# EAGLE design Pinscape Pico-KL25Z Adapter (EAGLE 7.7.0)

## Sheet 1 of 4: Main
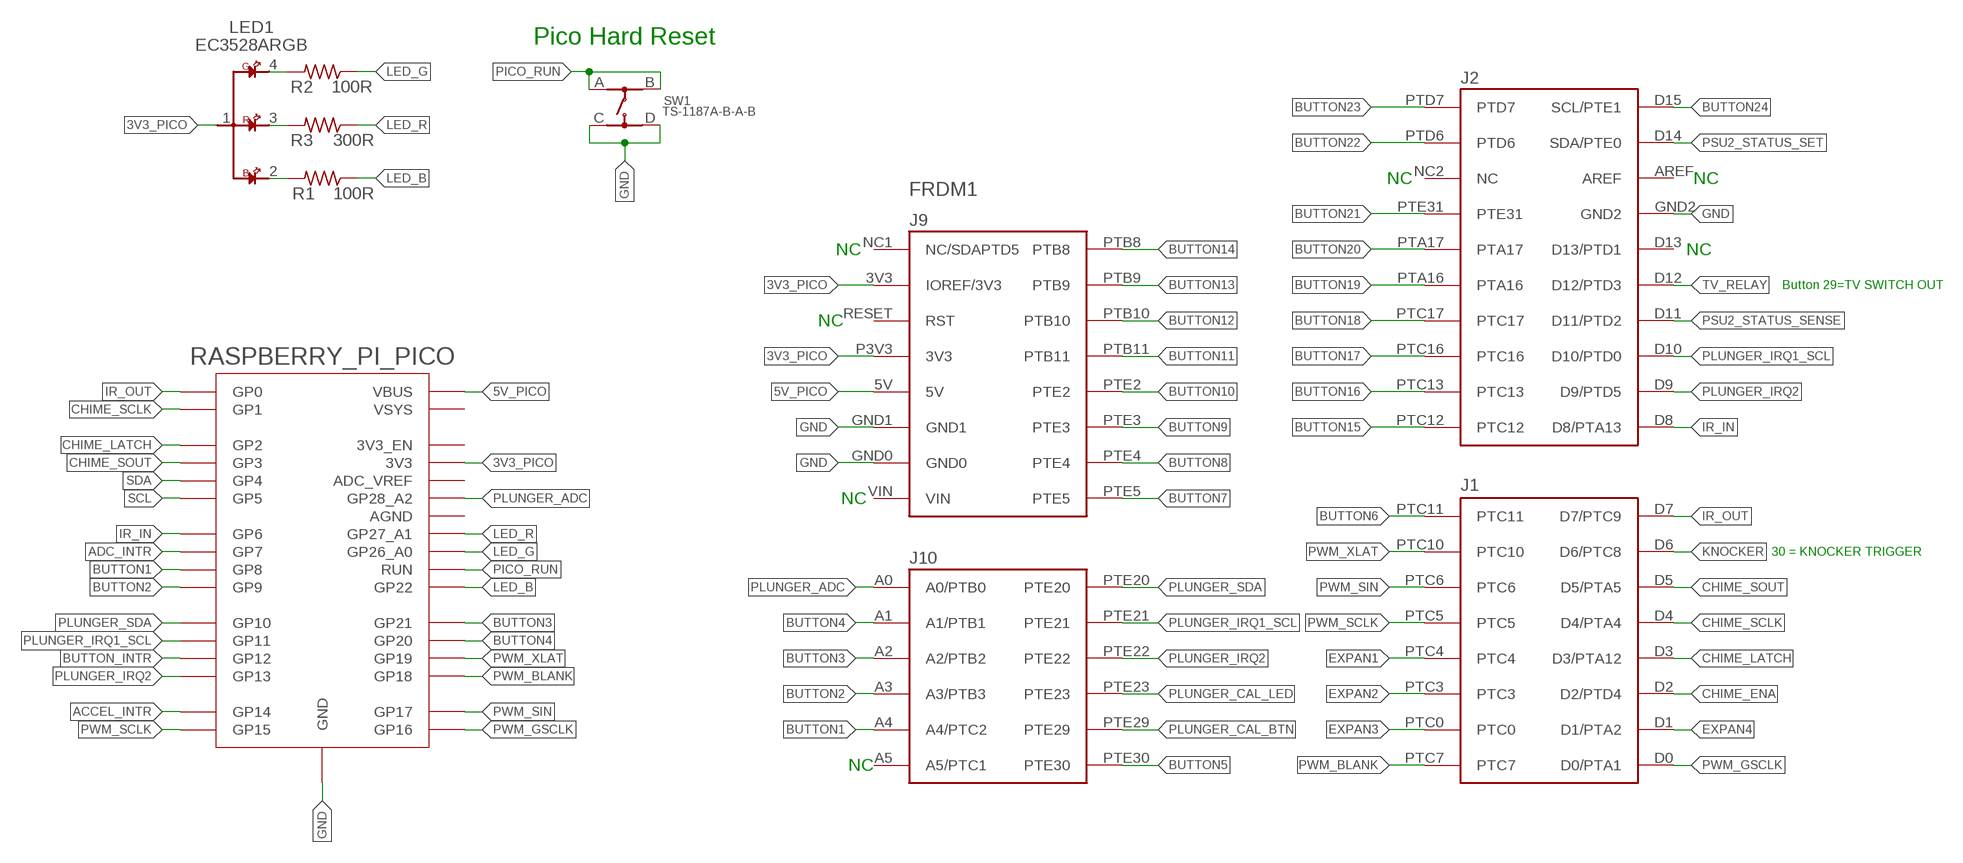
[diagram p0: schematic, sheet 1]

### Parts
FRDM1  KL25Z  FRDM-KL25ZNORMAL  [FRDM_KL25Z_NORMAL]
LED1  EC3528ARGB  [EC3528ARGB]
R1  100R  R-US_R1206  [R1206]
R2  100R  R-US_R1206  [R1206]
R3  300R  R-US_R1206  [R1206]
RASPBERRY_PI_PICO  RPI_PICO_NO_DEBUG  [RPI_PICO_TH_NO_DEBUG]
SW1  TS-1187A-B-A-B  [TS-1187A-B-A-B]

### Nets
3V3_PICO: FRDM1.3V3(IOREF/3V3) FRDM1.P3V3(3V3) LED1.1 RASPBERRY_PI_PICO.3V3 ; also sheet 2,3,4
5V_PICO: FRDM1.5V RASPBERRY_PI_PICO.VBUS
ACCEL_INTR: RASPBERRY_PI_PICO.GP14 ; also sheet 3
ADC_INTR: RASPBERRY_PI_PICO.GP7 ; also sheet 4
BUTTON1: FRDM1.A4(A4/PTC2) RASPBERRY_PI_PICO.GP8
BUTTON2: FRDM1.A3(A3/PTB3) RASPBERRY_PI_PICO.GP9
BUTTON3: FRDM1.A2(A2/PTB2) RASPBERRY_PI_PICO.GP21
BUTTON4: FRDM1.A1(A1/PTB1) RASPBERRY_PI_PICO.GP20
BUTTON5: FRDM1.PTE30 ; also sheet 2
BUTTON6: FRDM1.PTC11 ; also sheet 2
BUTTON7: FRDM1.PTE5 ; also sheet 2
BUTTON8: FRDM1.PTE4 ; also sheet 2
BUTTON9: FRDM1.PTE3 ; also sheet 2
BUTTON10: FRDM1.PTE2 ; also sheet 2
BUTTON11: FRDM1.PTB11 ; also sheet 2
BUTTON12: FRDM1.PTB10 ; also sheet 2
BUTTON13: FRDM1.PTB9 ; also sheet 2
BUTTON14: FRDM1.PTB8 ; also sheet 2
BUTTON15: FRDM1.PTC12 ; also sheet 2
BUTTON16: FRDM1.PTC13 ; also sheet 2
BUTTON17: FRDM1.PTC16 ; also sheet 2
BUTTON18: FRDM1.PTC17 ; also sheet 2
BUTTON19: FRDM1.PTA16 ; also sheet 2
BUTTON20: FRDM1.PTA17 ; also sheet 2
BUTTON21: FRDM1.PTE31 ; also sheet 2
BUTTON22: FRDM1.PTD6 ; also sheet 2
BUTTON23: FRDM1.PTD7 ; also sheet 2
BUTTON24: FRDM1.D15(SCL/PTE1) ; also sheet 2
BUTTON_INTR: RASPBERRY_PI_PICO.GP12 ; also sheet 2
CHIME_ENA: FRDM1.D2(D2/PTD4) ; also sheet 2
CHIME_LATCH: FRDM1.D3(D3/PTA12) RASPBERRY_PI_PICO.GP2
CHIME_SCLK: FRDM1.D4(D4/PTA4) RASPBERRY_PI_PICO.GP1
CHIME_SOUT: FRDM1.D5(D5/PTA5) RASPBERRY_PI_PICO.GP3
EXPAN1: FRDM1.PTC4 ; also sheet 2
EXPAN2: FRDM1.PTC3 ; also sheet 2
EXPAN3: FRDM1.PTC0 ; also sheet 2
EXPAN4: FRDM1.D1(D1/PTA2) ; also sheet 2
GND: FRDM1.GND0 FRDM1.GND1 FRDM1.GND2 RASPBERRY_PI_PICO.GND@1(GND) RASPBERRY_PI_PICO.GND@2(GND) RASPBERRY_PI_PICO.GND@3(GND) RASPBERRY_PI_PICO.GND@4(GND) RASPBERRY_PI_PICO.GND@6(GND) RASPBERRY_PI_PICO.GND@7(GND) RASPBERRY_PI_PICO.GND@8(GND) SW1.C SW1.D ; also sheet 2,3,4
IR_IN: FRDM1.D8(D8/PTA13) RASPBERRY_PI_PICO.GP6
IR_OUT: FRDM1.D7(D7/PTC9) RASPBERRY_PI_PICO.GP0
KNOCKER: FRDM1.D6(D6/PTC8) ; also sheet 2
LED_B: R1.1 RASPBERRY_PI_PICO.GP22
LED_G: R2.1 RASPBERRY_PI_PICO.GP26_A0
LED_R: R3.1 RASPBERRY_PI_PICO.GP27_A1
N$8: LED1.3 R3.2
N$10: LED1.2 R1.2
N$13: LED1.4 R2.2
PICO_RUN: RASPBERRY_PI_PICO.RUN SW1.A SW1.B
PLUNGER_ADC: FRDM1.A0(A0/PTB0) RASPBERRY_PI_PICO.GP28_A2 ; also sheet 4
PLUNGER_CAL_BTN: FRDM1.PTE29 ; also sheet 2
PLUNGER_CAL_LED: FRDM1.PTE23 ; also sheet 2
PLUNGER_IRQ1_SCL: FRDM1.D10(D10/PTD0) FRDM1.PTE21 RASPBERRY_PI_PICO.GP11
PLUNGER_IRQ2: FRDM1.D9(D9/PTD5) FRDM1.PTE22 RASPBERRY_PI_PICO.GP13
PLUNGER_SDA: FRDM1.PTE20 RASPBERRY_PI_PICO.GP10
PSU2_STATUS_SENSE: FRDM1.D11(D11/PTD2) ; also sheet 2
PSU2_STATUS_SET: FRDM1.D14(SDA/PTE0) ; also sheet 2
PWM_BLANK: FRDM1.PTC7 RASPBERRY_PI_PICO.GP18
PWM_GSCLK: FRDM1.D0(D0/PTA1) RASPBERRY_PI_PICO.GP16
PWM_SCLK: FRDM1.PTC5 RASPBERRY_PI_PICO.GP15
PWM_SIN: FRDM1.PTC6 RASPBERRY_PI_PICO.GP17
PWM_XLAT: FRDM1.PTC10 RASPBERRY_PI_PICO.GP19
SCL: RASPBERRY_PI_PICO.GP5 ; also sheet 2,3,4
SDA: RASPBERRY_PI_PICO.GP4 ; also sheet 2,3,4
TV_RELAY: FRDM1.D12(D12/PTD3) ; also sheet 2
Unconnected: FRDM1.A5(A5/PTC1) FRDM1.AREF FRDM1.D13(D13/PTD1) FRDM1.NC1(NC/SDAPTD5) FRDM1.NC2(NC) FRDM1.RESET(RST) FRDM1.VIN RASPBERRY_PI_PICO.3V3_EN RASPBERRY_PI_PICO.ADC_VREF RASPBERRY_PI_PICO.AGND RASPBERRY_PI_PICO.VSYS

### Notes on the sheet
- Pico Hard Reset
- NC | NC
- NC | NC
- Button 29=TV SWITCH OUT
- NC
- NC
- 30 = KNOCKER TRIGGER
- NC

## Sheet 2 of 4: PCA9555
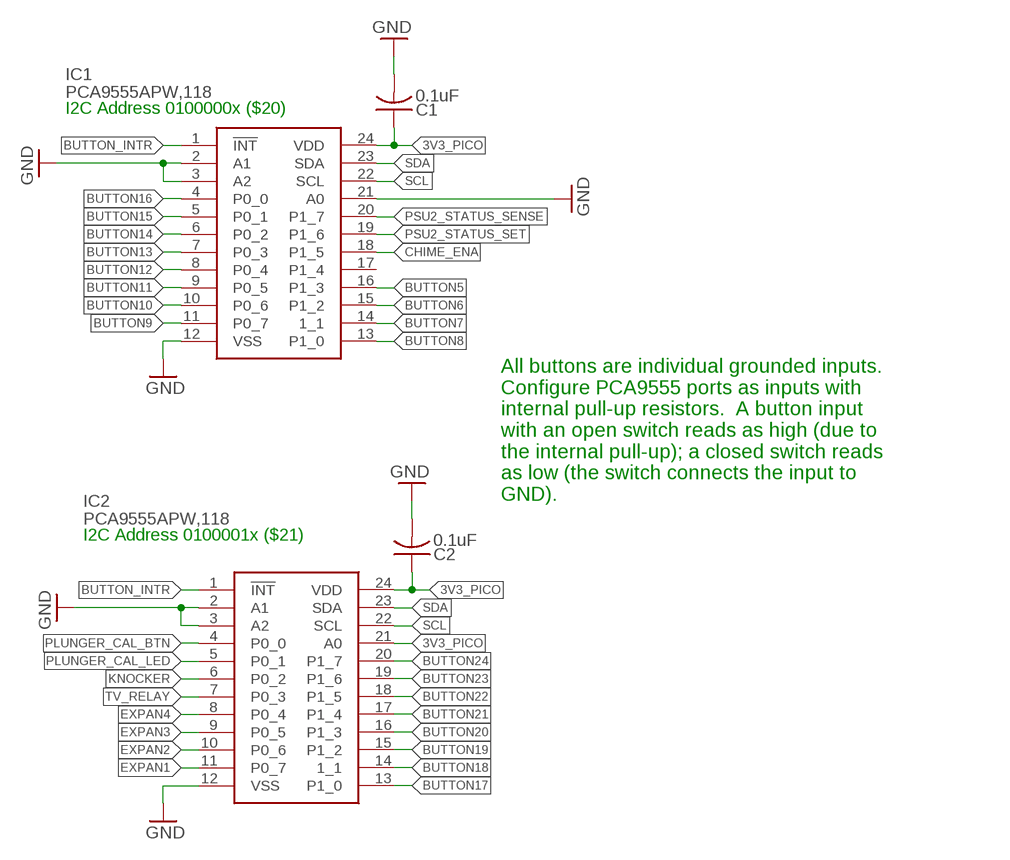
[diagram p1: schematic, sheet 2]

### Parts
C1  0.1uF  C-USC1206  [C1206]
C2  0.1uF  C-USC1206  [C1206]
IC1  PCA9555APW,118  [SOP65P640X110-24N]
IC2  PCA9555APW,118  [SOP65P640X110-24N]

### Nets
3V3_PICO: C1.1 C2.1 IC1.24(VDD) IC2.21(A0) IC2.24(VDD) ; also sheet 1,3,4
BUTTON5: IC1.16(P1_3) ; also sheet 1
BUTTON6: IC1.15(P1_2) ; also sheet 1
BUTTON7: IC1.14(1_1) ; also sheet 1
BUTTON8: IC1.13(P1_0) ; also sheet 1
BUTTON9: IC1.11(P0_7) ; also sheet 1
BUTTON10: IC1.10(P0_6) ; also sheet 1
BUTTON11: IC1.9(P0_5) ; also sheet 1
BUTTON12: IC1.8(P0_4) ; also sheet 1
BUTTON13: IC1.7(P0_3) ; also sheet 1
BUTTON14: IC1.6(P0_2) ; also sheet 1
BUTTON15: IC1.5(P0_1) ; also sheet 1
BUTTON16: IC1.4(P0_0) ; also sheet 1
BUTTON17: IC2.13(P1_0) ; also sheet 1
BUTTON18: IC2.14(1_1) ; also sheet 1
BUTTON19: IC2.15(P1_2) ; also sheet 1
BUTTON20: IC2.16(P1_3) ; also sheet 1
BUTTON21: IC2.17(P1_4) ; also sheet 1
BUTTON22: IC2.18(P1_5) ; also sheet 1
BUTTON23: IC2.19(P1_6) ; also sheet 1
BUTTON24: IC2.20(P1_7) ; also sheet 1
BUTTON_INTR: IC1.1(!INT) IC2.1(!INT) ; also sheet 1
CHIME_ENA: IC1.18(P1_5) ; also sheet 1
EXPAN1: IC2.11(P0_7) ; also sheet 1
EXPAN2: IC2.10(P0_6) ; also sheet 1
EXPAN3: IC2.9(P0_5) ; also sheet 1
EXPAN4: IC2.8(P0_4) ; also sheet 1
GND: C1.2 C2.2 IC1.2(A1) IC1.3(A2) IC1.12(VSS) IC1.21(A0) IC2.2(A1) IC2.3(A2) IC2.12(VSS) ; also sheet 1,3,4
KNOCKER: IC2.6(P0_2) ; also sheet 1
PLUNGER_CAL_BTN: IC2.4(P0_0) ; also sheet 1
PLUNGER_CAL_LED: IC2.5(P0_1) ; also sheet 1
PSU2_STATUS_SENSE: IC1.20(P1_7) ; also sheet 1
PSU2_STATUS_SET: IC1.19(P1_6) ; also sheet 1
SCL: IC1.22(SCL) IC2.22(SCL) ; also sheet 1,3,4
SDA: IC1.23(SDA) IC2.23(SDA) ; also sheet 1,3,4
TV_RELAY: IC2.7(P0_3) ; also sheet 1
Unconnected: IC1.17(P1_4)

### Notes on the sheet
- I2C Address 0100000x ($20)
- All buttons are individual grounded inputs.
  Configure PCA9555 ports as inputs with
  internal pull-up resistors.  A button input
  with an open switch reads as high (due to
  the internal pull-up); a closed switch reads
  as low (the switch connects the input to
  GND).
- I2C Address 0100001x ($21)

## Sheet 3 of 4: Accelerometer
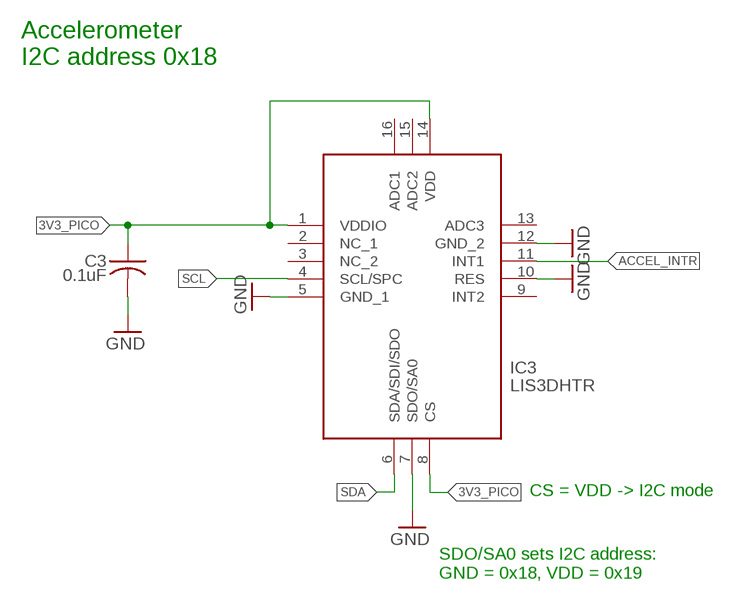
[diagram p2: schematic, sheet 3]

### Parts
C3  0.1uF  C-USC1206  [C1206]
IC3  LIS3DHTR  [LIS3DHTR]

### Nets
3V3_PICO: C3.1 IC3.1(VDDIO) IC3.8(CS) IC3.14(VDD) ; also sheet 1,2,4
ACCEL_INTR: IC3.11(INT1) ; also sheet 1
GND: C3.2 IC3.5(GND_1) IC3.7(SDO/SA0) IC3.10(RES) IC3.12(GND_2) ; also sheet 1,2,4
SCL: IC3.4(SCL/SPC) ; also sheet 1,2,4
SDA: IC3.6(SDA/SDI/SDO) ; also sheet 1,2,4
Unconnected: IC3.2(NC_1) IC3.3(NC_2) IC3.9(INT2) IC3.13(ADC3) IC3.15(ADC2) IC3.16(ADC1)

### Notes on the sheet
- Accelerometer
  I2C address 0x18
- CS = VDD -> I2C mode
- SDO/SA0 sets I2C address:
  GND = 0x18, VDD = 0x19

## Sheet 4 of 4: ADC
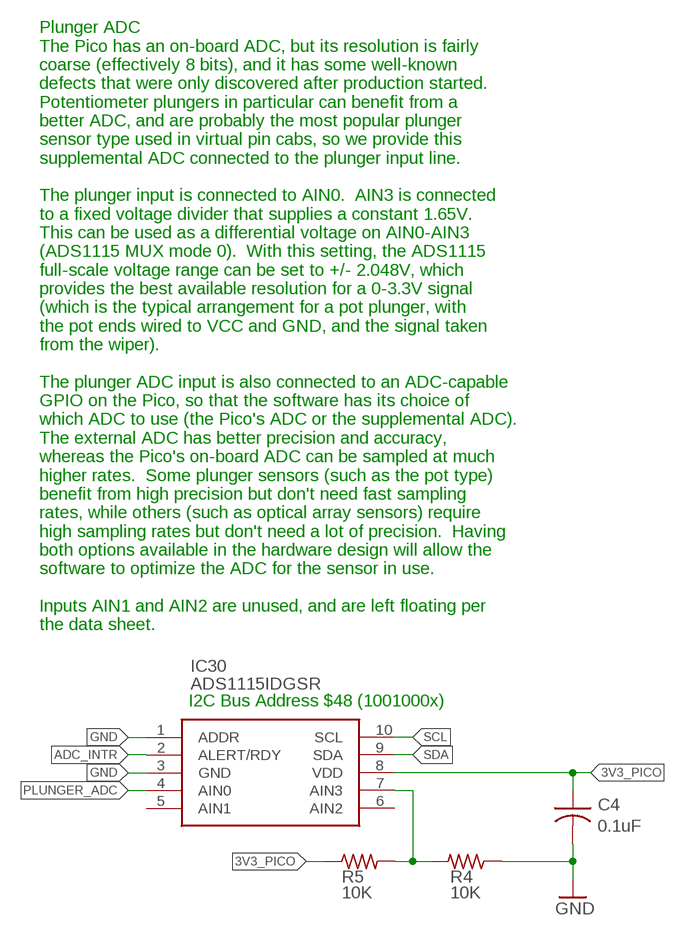
[diagram p3: schematic, sheet 4]

### Parts
C4  0.1uF  C-USC1206  [C1206]
IC30  ADS1115IDGSR  [SOP50P490X110-10N]
R4  10K  R-US_R1206  [R1206]
R5  10K  R-US_R1206  [R1206]

### Nets
3V3_PICO: C4.1 IC30.8(VDD) R5.1 ; also sheet 1,2,3
ADC_INTR: IC30.2(ALERT/RDY) ; also sheet 1
GND: C4.2 IC30.1(ADDR) IC30.3(GND) R4.1 ; also sheet 1,2,3
N$71: IC30.7(AIN3) R4.2 R5.2
PLUNGER_ADC: IC30.4(AIN0) ; also sheet 1
SCL: IC30.10(SCL) ; also sheet 1,2,3
SDA: IC30.9(SDA) ; also sheet 1,2,3
Unconnected: IC30.5(AIN1) IC30.6(AIN2)

### Notes on the sheet
- Plunger ADC
  The Pico has an on-board ADC, but its resolution is fairly
  coarse (effectively 8 bits), and it has some well-known
  defects that were only discovered after production started.
  Potentiometer plungers in particular can benefit from a
  better ADC, and are probably the most popular plunger
  sensor type used in virtual pin cabs, so we provide this
  supplemental ADC connected to the plunger input line.
  
  The plunger input is connected to AIN0.  AIN3 is connected
  to a fixed voltage divider that supplies a constant 1.65V.
  This can be used as a differential voltage on AIN0-AIN3
  (ADS1115 MUX mode 0).  With this setting, the ADS1115
  full-scale voltage range can be set to +/- 2.048V, which
  provides the best available resolution for a 0-3.3V signal
  (which is the typical arrangement for a pot plunger, with
  the pot ends wired to VCC and GND, and the signal taken
  from the wiper).
  
  The plunger ADC input is also connected to an ADC-capable
  GPIO on the Pico, so that the software has its choice of
  which ADC to use (the Pico's ADC or the supplemental ADC).
  The external ADC has better precision and accuracy,
  whereas the Pico's on-board ADC can be sampled at much
  higher rates.  Some plunger sensors (such as the pot type)
  benefit from high precision but don't need fast sampling
  rates, while others (such as optical array sensors) require
  high sampling rates but don't need a lot of precision.  Having
  both options available in the hardware design will allow the
  software to optimize the ADC for the sensor in use.
  
  Inputs AIN1 and AIN2 are unused, and are left floating per
  the data sheet.
- I2C Bus Address $48 (1001000x)

## Library data of the parts
C1-C4 = rcl:C-US: CAPACITOR, American symbol
FRDM1 = kl25z:FRDM-KL25Z: For creating FRDM-KL25Z shields
IC1 IC2 = SamacSys_Parts:PCA9555APW,118: NXP - PCA9555APW,118 - I/O EXPANDER, 16BIT, 400KHZ, TSSOP-24 Source: Datasheet <http://www.nxp.com/docs/en/data-sheet/PCA9555A.pdf>; DESCRIPTION: NXP - PCA9555APW,118 - I/O EXPANDER, 16BIT, 400KHZ, TSSOP-24; HEIGHT: 1.1mm; MANUFACTURER_NAME: NXP; MANUFACTURER_PART_NUMBER: PCA9555APW,118; MOUSER_PART_NUMBER: 771-PCA9555APW118; MOUSER_PRICE-STOCK: https://www.mouser.co.uk/ProductDetail/NXP-Semiconductors/PCA9555APW118?qs=5C9Q4QJFsuPmpoGpn%2FKoIQ%3D%3D
IC3 = SamacSys_Parts:LIS3DHTR: Accelerometer 3-Axis 2g/16g 1.8V LGA16 STMicroelectronics LIS3DHTR Accelerometer IC, 3-axis, I2C, SPI 1.71 3.6 V, 16-Pin LGA Source: Datasheet <http://www.st.com/content/ccc/resource/technical/document/datasheet/3c/ae/50/85/d6/b1/46/fe/CD00274221.pdf/files/CD00274221.pdf/jcr:content/translations/en.CD00274221.pdf>; DESCRIPTION: Accelerometer 3-Axis 2g/16g 1.8V LGA16 STMicroelectronics LIS3DHTR Accelerometer IC, 3-axis, I2C, SPI 1.71 3.6 V, 16-Pin LGA; HEIGHT: 1mm; MANUFACTURER_NAME: STMicroelectronics; MANUFACTURER_PART_NUMBER: LIS3DHTR; MOUSER_PART_NUMBER: 511-LIS3DHTR; MOUSER_PRICE-STOCK: https://www.mouser.co.uk/ProductDetail/STMicroelectronics/LIS3DHTR?qs=6la6oa3D8xzhXYax3cEo4w%3D%3D
IC30 = SamacSys_Parts:ADS1115IDGSR: 16-Bit 860SPS 4-Ch Delta-Sigma ADC With PGA, Oscillator, Vref, Comparator, and I2C Source: Datasheet <http://www.ti.com/lit/gpn/ADS1115>; DESCRIPTION: 16-Bit 860SPS 4-Ch Delta-Sigma ADC With PGA, Oscillator, Vref, Comparator, and I2C; HEIGHT: 1.1mm; MANUFACTURER_NAME: Texas Instruments; MANUFACTURER_PART_NUMBER: ADS1115IDGSR; MOUSER_PART_NUMBER: 595-ADS1115IDGSR; MOUSER_PRICE-STOCK: https://www.mouser.co.uk/ProductDetail/Texas-Instruments/ADS1115IDGSR?qs=IK5e5L0zOXjKCJoVMhYO%2FQ%3D%3D
LED1 = SamacSys_Parts:EC3528ARGB: EC3528ARGB RGB LED, 5mA, common anode, SMD 3528 package; Dongguan Ousike Optoelectronics Technology Co., Ltd.
R1-R5 = resistor:R-US_: RESISTOR, American symbol
RASPBERRY_PI_PICO = RaspberryPi_Pico:RPI_PICO_NO_DEBUG
SW1 = SamacSys_Parts:TS-1187A-B-A-B

## Board
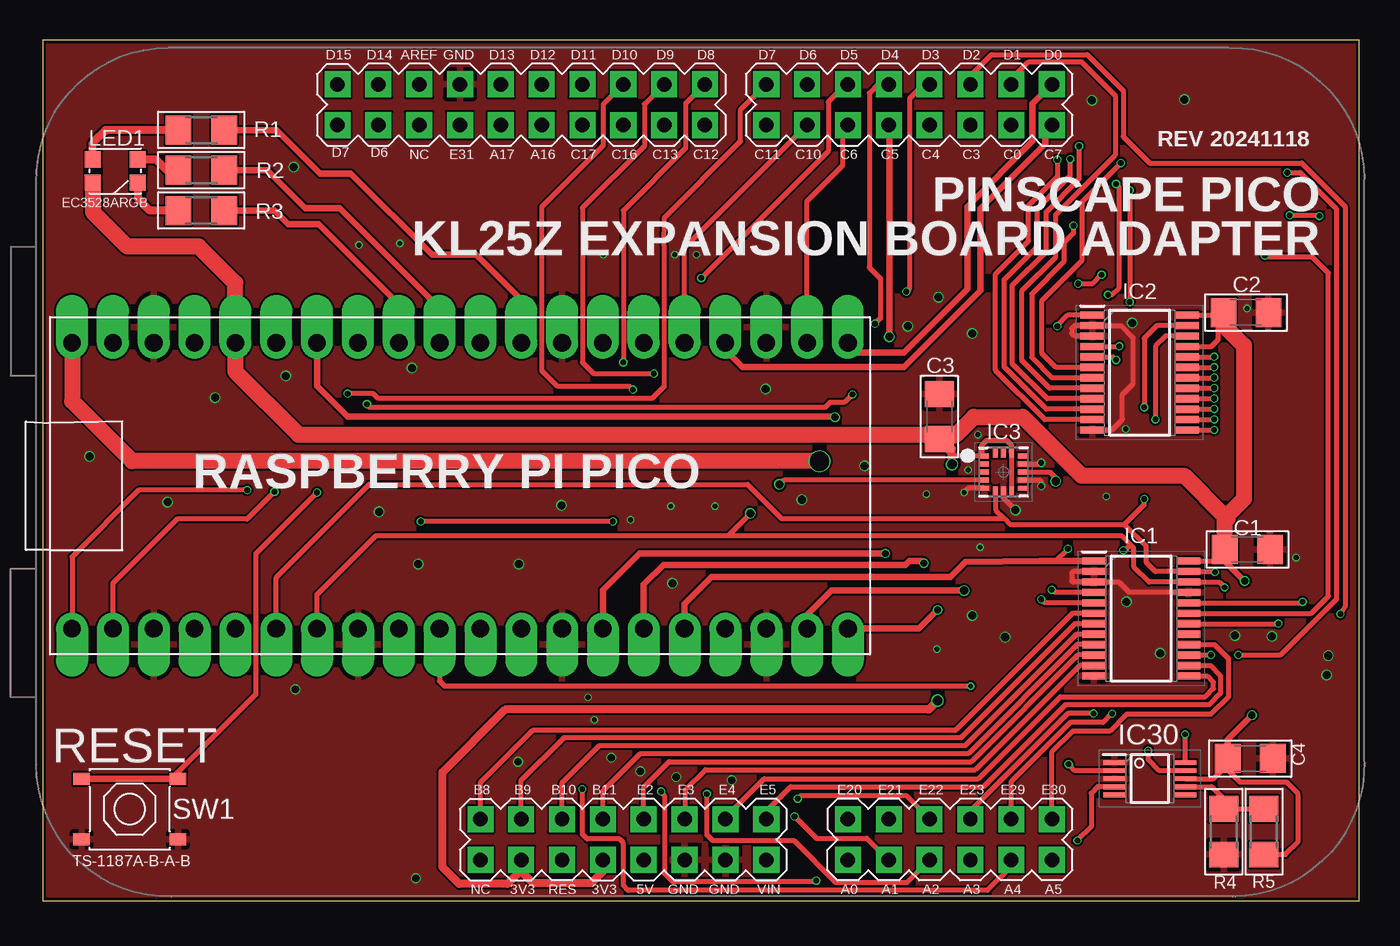
[diagram p4: board, top side]
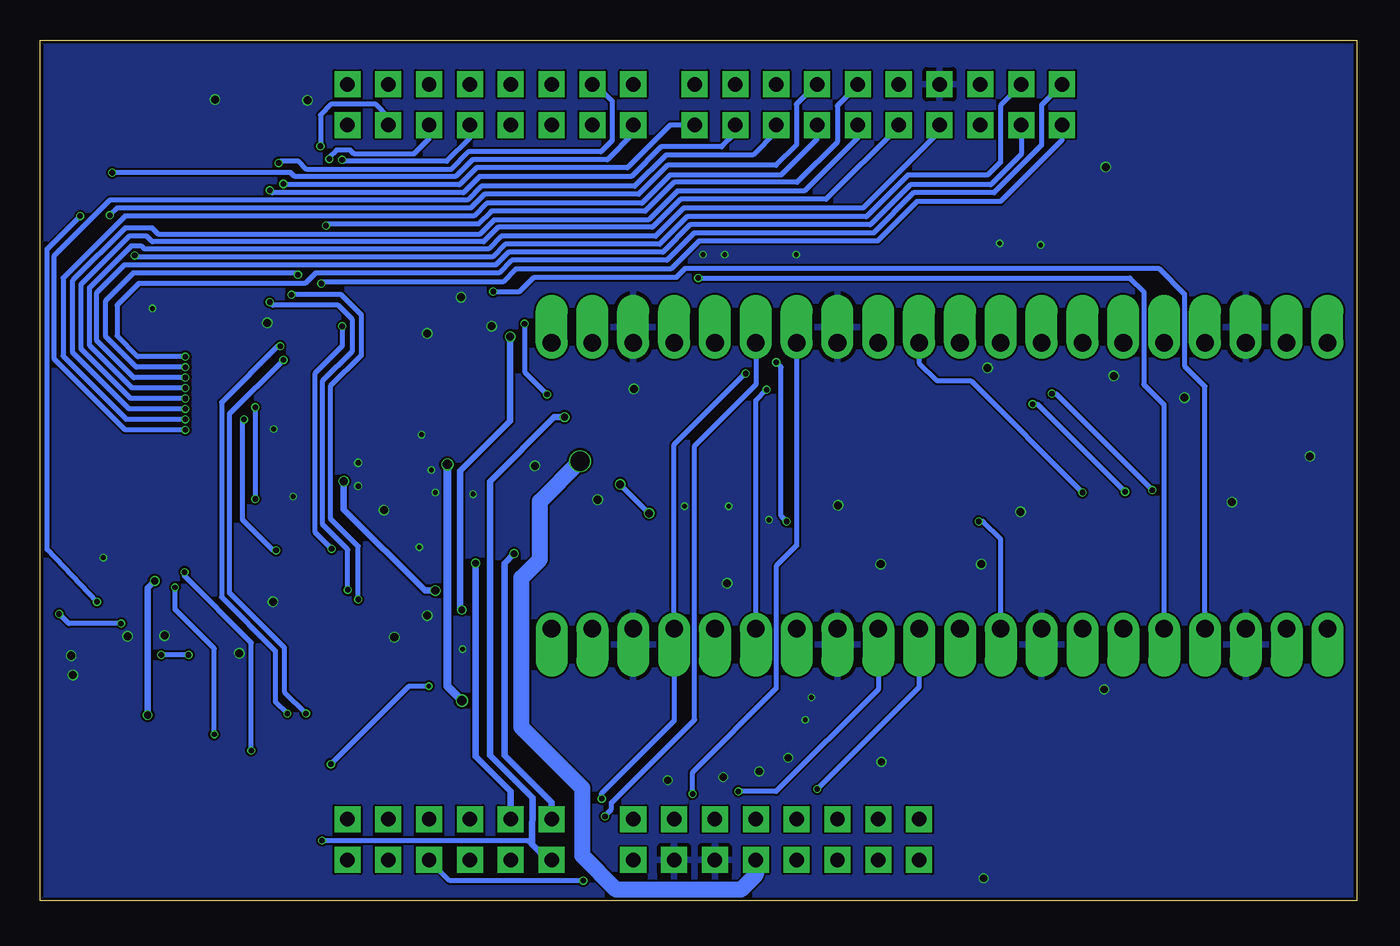
[diagram p5: board, bottom side, seen from below]

Size 81.88 x 53.54 mm. Coordinates in mm from the lower left corner, seen from the top.
Outline: 0,0 81.88,0 81.88,53.54 0,53.54 0,0
Copper layers (1*16): Top 0.035mm / dielectric 1.6mm / Bottom 0.035mm
Design rules "jlcpcb-2layers": minimum track width 5mil, minimum drill 0.3mm, track to track 5mil, track to pad 5mil, pad to pad 5mil, via to via 5mil, smd to smd 5mil, copper to edge 0.2mm, drill to drill 6mil, minimum pad ring 10mil, minimum via ring 3mil, stop-mask expansion 4mil, vias tented up to drill 0mil, thermal gap 10mil

### Footprints (pad centres in the part's own frame; a part is rotated, then mirrored left to right if it is on the bottom)
C1206 = smd 1.6 x 1.8: 1 -1.4,0; 2 1.4,0
FRDM_KL25Z_NORMAL = drill 0.9 square: 3V3 24.13,-15.24; 5V 24.13,-7.62; A0 24.13,5.08; A1 24.13,7.62; A2 24.13,10.16; A3 24.13,12.7; A4 24.13,15.24; A5 24.13,17.78; AREF -24.13,-21.59; D0 -24.13,17.78; D1 -24.13,15.24; D2 -24.13,12.7; D3 -24.13,10.16; D4 -24.13,7.62; D5 -24.13,5.08; D6 -24.13,2.54; D7 -24.13,0; D8 -24.13,-3.81; D9 -24.13,-6.35; D10 -24.13,-8.89; D11 -24.13,-11.43; D12 -24.13,-13.97; D13 -24.13,-16.51; D14 -24.13,-24.13; D15 -24.13,-26.67; GND0 24.13,-2.54; GND1 24.13,-5.08; GND2 -24.13,-19.05; NC1 24.13,-17.78; NC2 -21.59,-21.59; P3V3 24.13,-10.16; PTA16 -21.59,-13.97; PTA17 -21.59,-16.51; PTB8 21.59,-17.78; PTB9 21.59,-15.24; PTB10 21.59,-12.7; PTB11 21.59,-10.16; PTC0 -21.59,15.24; PTC3 -21.59,12.7; PTC4 -21.59,10.16; PTC5 -21.59,7.62; PTC6 -21.59,5.08; PTC7 -21.59,17.78; PTC10 -21.59,2.54; PTC11 -21.59,0; PTC12 -21.59,-3.81; PTC13 -21.59,-6.35; PTC16 -21.59,-8.89; PTC17 -21.59,-11.43; PTD6 -21.59,-24.13; PTD7 -21.59,-26.67; PTE2 21.59,-7.62; PTE3 21.59,-5.08; PTE4 21.59,-2.54; PTE5 21.59,0; PTE20 21.59,5.08; PTE21 21.59,7.62; PTE22 21.59,10.16; PTE23 21.59,12.7; PTE29 21.59,15.24; PTE30 21.59,17.78; PTE31 -21.59,-19.05; RESET 24.13,-12.7; VIN 24.13,0
SOP65P640X110-24N = smd 1.475 x 0.45: 1 -2.938,3.575; 2 -2.938,2.925; 3 -2.938,2.275; 4 -2.938,1.625; 5 -2.938,0.975; 6 -2.938,0.325; 7 -2.938,-0.325; 8 -2.938,-0.975; 9 -2.938,-1.625; 10 -2.938,-2.275; 11 -2.938,-2.925; 12 -2.938,-3.575; 13 2.938,-3.575; 14 2.938,-2.925; 15 2.938,-2.275; 16 2.938,-1.625; 17 2.938,-0.975; 18 2.938,-0.325; 19 2.938,0.325; 20 2.938,0.975; 21 2.938,1.625; 22 2.938,2.275; 23 2.938,2.925; 24 2.938,3.575
LIS3DHTR = smd 0.6 x 0.3: 1 -1.2,1; 2 -1.2,0.5; 3 -1.2,0; 4 -1.2,-0.5; 5 -1.2,-1; 9 1.2,-1; 10 1.2,-0.5; 11 1.2,0; 12 1.2,0.5; 13 1.2,1 | smd 0.3 x 0.6: 6 -0.5,-1.2; 7 0,-1.2; 8 0.5,-1.2; 14 0.5,1.2; 15 0,1.2; 16 -0.5,1.2
SOP50P490X110-10N = smd 1.4 x 0.3: 1 -2.2,1; 2 -2.2,0.5; 3 -2.2,0; 4 -2.2,-0.5; 5 -2.2,-1; 6 2.2,-1; 7 2.2,-0.5; 8 2.2,0; 9 2.2,0.5; 10 2.2,1
EC3528ARGB = smd 1 x 1: 1 -0.725,1.4; 2 0.725,1.4; 3 -0.725,-1.4; 4 0.725,-1.4
R1206 = smd 1.6 x 1.803: 1 -1.422,0; 2 1.422,0
RPI_PICO_TH_NO_DEBUG = drill 1.1 pad 1.6 offset: 3V3 8.89,13.97; 3V3_EN 8.89,16.51; ADC_VREF 8.89,11.43; AGND 8.89,6.35; GND@1 -8.89,19.05; GND@2 -8.89,6.35; GND@3 -8.89,-6.35; GND@4 -8.89,-19.05; GND@6 8.89,-19.05; GND@7 8.89,-6.35; GND@8 8.89,19.05; GP0 -8.89,24.13; GP1 -8.89,21.59; GP2 -8.89,16.51; GP3 -8.89,13.97; GP4 -8.89,11.43; GP5 -8.89,8.89; GP6 -8.89,3.81; GP7 -8.89,1.27; GP8 -8.89,-1.27; GP9 -8.89,-3.81; GP10 -8.89,-8.89; GP11 -8.89,-11.43; GP12 -8.89,-13.97; GP13 -8.89,-16.51; GP14 -8.89,-21.59; GP15 -8.89,-24.13; GP16 8.89,-24.13; GP17 8.89,-21.59; GP18 8.89,-16.51; GP19 8.89,-13.97; GP20 8.89,-11.43; GP21 8.89,-8.89; GP22 8.89,-3.81; GP26_A0 8.89,1.27; GP27_A1 8.89,3.81; GP28_A2 8.89,8.89; RUN 8.89,-1.27; VBUS 8.89,24.13; VSYS 8.89,21.59
TS-1187A-B-A-B = smd 1 x 0.75: A -3,1.875; B 3,1.875; C -3,-1.875; D 3,-1.875

### Placement (x,y rotation side)
C1  74.92,21.86 0 top
C2  74.83,36.6 0 top
C3  55.76,30.13 90 top
C4  75.1,8.85 0 top
FRDM1  44.99,26.67 270 top
IC1  68.32,17.56 0 top
IC2  68.22,32.86 0 top
IC3  59.75,26.67 0 top
IC30  68.85,7.6 0 top
LED1  4.5,45.4 90 top
R1  9.85,47.95 180 top
R2  9.85,45.45 180 top
R3  9.85,42.95 180 top
R4  73.45,4.3 90 top
R5  75.95,4.3 90 top
RASPBERRY_PI_PICO  25.94,25.82 90 top
SW1  5.4,5.7 0 top

### Tracks (layer width: path | path; a pad name or v marks a point on that pad's centre or on a via)
3V3_PICO  (via drill 0.45, 0.6)
  Top 0.3: IC1.24 73.5,21.14 C1.1 | IC2.24 73.14,36.44 C2.1 73.1,36.32 73.1,34.9 72.69,34.48 IC2.21 | C3.1 56.52,27.67 IC3.1 58.4,27.82 58.4,28.35 58.7,28.65 59.95,28.65 60.25,28.35 IC3.14 IC3.8 | IC30.8 72.8,7.6 73.7,8.5 | 73.7,8.5 C4.1 | 75.95,2.45 R5.1 77.28,2.88 78.05,3.65 78.05,6.7 77.35,7.4 74.45,7.4 73.7,8.15 73.7,8.5
  Top 0.4: C4.1 73.7,10.05 v75.2,11.55 | v74.75,19.9 74.75,19.88 73.5,21.14
  Top 0.5: FRDM1.P3V3 34.83,1.83 34.1,1.1 30.5,1.1 29.75,1.85 FRDM1.3V3 29.75,1.9 28.9,1.05 25.9,1.05 24.85,2.1 24.85,8 28.75,11.9 55.1,11.9 v55.65,12.45 | v56.55,27.15 56.55,28.12 C3.1
  Top 1: 73.52,23.92 70.99,26.45 64.6,26.45 60.95,30.1 57.9,30.1 56.75,28.95 55.25,28.95 | 73.52,23.92 73.57,23.87 | 73.57,23.87 73.67,23.77 | C1.1 73.52,23.92 | C3.1 55.72,28.48 55.25,28.95 | 55.25,28.95 55.2,29 15.9,29 11.97,32.93 RASPBERRY_PI_PICO.3V3 11.97,38.43 9.7,40.7 5.25,40.7 3.1,42.85 LED1.1 | C2.1 73.43,35.82 74.7,34.55 74.7,25 73.57,23.87
  Bottom 0.4: v75.2,11.55 75.2,19.45 v74.75,19.9
  Bottom 0.5: v56.55,27.15 56.55,13.35 v55.65,12.45
5V_PICO  (via drill 1.2)
  Top 1: v48.3,27.35 5.55,27.35 1.81,31.09 RASPBERRY_PI_PICO.VBUS
  Bottom 1: FRDM1.5V 37.37,1.63 38.3,0.7 46.05,0.7 48.15,2.8 48.15,7 51.95,10.8 51.95,20.1 50.8,21.25 50.8,24.85 v48.3,27.35
ACCEL_INTR  (via drill 0.5)
  Top 0.3: IC3.11 62.63,26.67 63,26.3 v63,26.1
  Top 0.4: v57.3,19.3 49.05,19.3 47.53,17.78 RASPBERRY_PI_PICO.GP14
  Bottom 0.4: v63,26.1 63,24.35 57.95,19.3 v57.3,19.3
ADC_INTR  (via drill 0.3, 0.35)
  Top 0.3: IC30.2 64.2,8.1 v63.8,8.5 | v57.7,13.35 25,13.35 24.67,13.68 RASPBERRY_PI_PICO.GP7
  Bottom 0.3: v63.8,8.5 58.95,13.35 v57.7,13.35
BUTTON1  (via drill 0.33)
  Top 0.3: FRDM1.A4 60.23,2.13 58.75,0.65 36.4,0.65 36.1,0.95 36.1,3.6 35.85,3.85 33.85,3.85 33.55,4.15 v33.55,6.95
  Bottom 0.3: RASPBERRY_PI_PICO.GP8 27.21,13.29 v33.55,6.95
BUTTON2  (via drill 0.35)
  Top 0.3: v38.45,6.8 38.45,6.75 38.65,6.55 38.65,1.7 39.15,1.2 48.05,1.2 v48.1,1.25
  Bottom 0.3: RASPBERRY_PI_PICO.GP9 29.75,13.15 36.1,6.8 v38.45,6.8 | v48.1,1.25 56.4,1.25 FRDM1.A3
BUTTON3  (via drill 0.35)
  Top 0.3: FRDM1.A2 53.76,1.15 49.3,1.15 46.7,3.75 41.65,3.75 41.3,4.1 v41.3,6.65
  Bottom 0.3: RASPBERRY_PI_PICO.GP21 34.83,22.1 36.1,20.83 36.1,13.2 41.3,8 v41.3,6.65
BUTTON4  (via drill 0.35)
  Top 0.3: v46.75,5.25 48.1,3.9 51.25,3.9 FRDM1.A1
  Bottom 0.3: v46.75,5.25 46.75,5.3 46.35,5.7 46.35,6.1 41.18,11.27 41.18,28.3 37.37,32.11 RASPBERRY_PI_PICO.GP20
BUTTON5
  Top 0.3: IC1.16 72.86,15.94 73.75,15.05 73.75,12.7 72.65,11.6 67.4,11.6 66.35,10.55 64.05,10.55 62.77,9.27 FRDM1.PTE30
BUTTON6  (via drill 0.35)
  Top 0.3: v77.4,45.3 78.2,45.3 80.45,43.05 80.45,18.75 77,15.3 v74.35,15.3 | IC1.15 72.64,15.29 v72.65,15.3
  Bottom 0.3: FRDM1.PTC11 44.99,47.71 46.6,46.1 55,46.1 56.05,45.05 66.05,45.05 66.3,45.3 v77.4,45.3 | v72.65,15.3 v74.35,15.3
BUTTON7
  Top 0.3: FRDM1.PTE5 44.99,5.59 46.5,7.1 58.5,7.1 63.6,12.2 72.55,12.2 73.25,12.9 73.25,14 72.61,14.63 IC1.14
BUTTON8
  Top 0.3: FRDM1.PTE4 42.45,5.2 44.85,7.6 58.2,7.6 63.3,12.7 72.3,12.7 72.8,13.2 72.8,13.6 72.42,13.98 IC1.13
BUTTON9
  Top 0.3: IC1.11 64.48,14.63 58,8.15 41.2,8.15 39.95,6.9 39.95,5.12 FRDM1.PTE3
BUTTON10
  Top 0.3: FRDM1.PTE2 37.37,7.07 38.95,8.65 57.75,8.65 64.39,15.29 IC1.10
BUTTON11
  Top 0.3: FRDM1.PTB11 34.83,6.83 37.15,9.15 57.55,9.15 64.33,15.94 IC1.9
BUTTON12
  Top 0.3: FRDM1.PTB10 32.29,7.34 34.6,9.65 57.35,9.65 64.28,16.59 IC1.8
BUTTON13
  Top 0.3: FRDM1.PTB9 29.75,7.5 32.4,10.15 57.1,10.15 64.19,17.23 IC1.7
BUTTON14
  Top 0.3: FRDM1.PTB8 27.21,7.36 30.45,10.6 56.75,10.6 64.03,17.89 IC1.6
BUTTON15  (via drill 0.35)
  Top 0.3: IC1.5 62.31,18.54 v62.1,18.75 | v66.25,37.7 66.5,37.7 66.95,38.15 66.95,44.4 v66.75,44.6
  Bottom 0.3: FRDM1.PTC12 42.69,48.26 45.35,45.6 54.75,45.6 55.8,44.55 66.7,44.55 v66.75,44.6 | v62.1,18.75 62.1,22.05 63.8,23.75 63.8,32.05 61.9,33.95 61.9,36.45 63.15,37.7 v66.25,37.7
BUTTON16  (via drill 0.35)
  Top 0.3: IC1.4 62.91,19.18 v62.75,19.35 | v67.6,44.2 v67.6,37.25
  Bottom 0.3: FRDM1.PTC13 38.64,47.76 39.5,46.9 43.25,46.9 45.1,45.05 54.55,45.05 55.55,44.05 67.45,44.05 v67.6,44.2 | v62.75,19.35 62.75,21.85 64.3,23.4 64.3,32.35 62.45,34.2 62.45,36.15 63.35,37.05 67.4,37.05 v67.6,37.25
BUTTON17  (via drill 0.35)
  Top 0.3: IC2.13 72.83,29.29 v72.85,29.3
  Bottom 0.3: FRDM1.PTC16 36.1,47.85 37.55,46.4 42.95,46.4 44.9,44.45 54.45,44.45 55.3,43.6 77.55,43.6 81,40.15 81,33.7 76.6,29.3 v72.85,29.3
BUTTON18  (via drill 0.35)
  Top 0.3: IC2.14 72.83,29.93 v72.85,29.95
  Bottom 0.3: FRDM1.PTC17 33.56,47.39 35.8,45.15 42.7,45.15 44.45,43.4 54.1,43.4 54.9,42.6 76.6,42.6 80.45,38.75 80.45,33.9 76.5,29.95 v72.85,29.95
BUTTON19  (via drill 0.35)
  Top 0.3: IC2.15 72.83,30.59 v72.85,30.6
  Bottom 0.3: FRDM1.PTA16 31.02,47.48 34.35,44.15 42.25,44.15 44.05,42.35 53.65,42.35 54.55,41.45 74.5,41.45 74.9,41.85 76.6,41.85 79.85,38.6 79.85,34.1 76.35,30.6 v72.85,30.6
BUTTON20  (via drill 0.35)
  Top 0.3: IC2.16 72.83,31.23 v72.85,31.25
  Bottom 0.3: FRDM1.PTA17 28.48,48.17 33,43.65 42.05,43.65 43.8,41.9 53.4,41.9 54.3,41 74.9,41 75.25,41.35 76.35,41.35 79.35,38.35 79.35,34.35 76.25,31.25 v72.85,31.25
BUTTON21  (via drill 0.35)
  Top 0.3: IC2.17 72.83,31.89 v72.85,31.9
  Bottom 0.3: FRDM1.PTE31 25.94,47.86 30.7,43.1 41.85,43.1 43.6,41.35 53.2,41.35 54,40.55 75.4,40.55 75.6,40.75 76.2,40.75 78.8,38.15 78.8,34.55 76.15,31.9 v72.85,31.9
BUTTON22  (via drill 0.35)
  Top 0.3: IC2.18 72.83,32.53 v72.85,32.55
  Bottom 0.3: FRDM1.PTD6 20.86,46.44 22.75,44.55 27.75,44.55 30.25,42.05 41.45,42.05 43.15,40.35 52.75,40.35 53.55,39.55 76.65,39.55 78.35,37.85 78.35,34.85 76.05,32.55 v72.85,32.55
BUTTON23  (via drill 0.35)
  Top 0.3: v64.4,38.4 65.3,38.4 v65.85,38.95 | IC2.19 72.83,33.19 v72.85,33.2
  Bottom 0.3: FRDM1.PTD7 18.32,47.33 22.15,43.5 27.35,43.5 29.8,41.05 40.9,41.05 42.65,39.3 52.3,39.3 53.1,38.5 64.35,38.5 v64.4,38.4 | v65.85,38.95 65.95,39.05 76.1,39.05 77.8,37.35 77.8,35.1 75.9,33.2 v72.85,33.2
BUTTON24  (via drill 0.35)
  Top 0.3: IC2.20 72.83,33.84 v72.85,33.85
  Bottom 0.3: FRDM1.D15 18.32,50.78 19.6,49.5 19.6,47 22.55,44.05 27.55,44.05 30.05,41.55 41.2,41.55 42.9,39.85 52.55,39.85 53.35,39.05 64.75,39.05 65.4,38.4 75.75,38.4 77.1,37.05 77.1,35.15 75.8,33.85 v72.85,33.85
BUTTON_INTR  (via drill 0.35)
  Top 0.3: IC2.1 63.73,36.44 63.1,35.8 v63.1,35.75 | 62.05,21.14 62.98,21.14 v63.75,21.9
  Top 0.4: RASPBERRY_PI_PICO.GP12 39.91,18.46 41.6,20.15 56.45,20.15 57.38,21.09 62.05,21.14 IC1.1
  Bottom 0.3: v63.1,35.75 63.1,34.5 64.8,32.8 64.8,22.95 v63.75,21.9
CHIME_ENA  (via drill 0.35)
  Top 0.3: FRDM1.D2 57.69,51.34 59,52.65 64.95,52.65 67.2,50.4 67.2,47.55 68.85,45.9 78.3,45.9 81,43.2 81,18.3 v80.7,17.85 | IC1.18 76.83,17.23 v76.85,17.25
  Bottom 0.3: v76.85,17.25 80.1,17.25 v80.7,17.85
CHIME_LATCH  (via drill 0.35)
  Top 0.3: FRDM1.D3 54.8,50.8 53.9,49.9 53.9,38.1 v53.7,37.9
  Bottom 0.3: RASPBERRY_PI_PICO.GP2 9.43,32 10.7,33.27 10.7,37.75 12.3,39.35 41.75,39.35 42.3,38.8 51.15,38.8 52.05,37.9 v53.7,37.9
CHIME_SCLK  (via drill 0.35)
  Top 0.3: FRDM1.D4 51.95,50.8 51.4,50.25 51.4,39.4 52.1,38.7 52.1,36.25 v51.75,35.9 | v50.35,31.5 49.85,31 48.95,31 48.65,30.7 20.35,30.7 v20.15,30.9 | RASPBERRY_PI_PICO.GP1 4.35,19.75 8.35,23.75 12.7,23.75 v14.4,25.45
  Bottom 0.3: v51.75,35.9 51.75,32.9 v50.35,31.5 | v20.15,30.9 19.85,30.9 v14.4,25.45
CHIME_SOUT  (via drill 0.35)
  Top 0.25: FRDM1.D5 49.95,50.8
  Top 0.3: 49.95,50.8 48.85,49.7 48.85,46.65 v40.95,38.75
  Bottom 0.3: RASPBERRY_PI_PICO.GP3 11.97,30.85 13.24,32.12 13.24,37.9 14.09,38.75 v40.95,38.75
EXPAN1  (via drill 0.35)
  Top 0.3: IC2.11 62.31,29.93 59.25,33 59.25,39 61.3,41.05 61.3,43.25 63.1,45.05 v63.1,46.1
  Bottom 0.3: FRDM1.PTC4 55.15,47.45 56.6,46 63,46 v63.1,46.1
EXPAN2  (via drill 0.35)
  Top 0.3: IC2.10 62.41,30.59 59.8,33.2 59.8,38.65 61.85,40.7 61.85,43.05 63.9,45.1 v63.9,46.15
  Bottom 0.3: FRDM1.PTC3 57.69,47.41 58.65,46.45 62.35,46.45 62.6,46.7 63.45,46.7 63.9,46.25 v63.9,46.15
EXPAN3  (via drill 0.35)
  Top 0.3: IC2.9 62.47,31.23 60.3,33.4 60.3,38.3 62.4,40.4 62.4,42.85 64.45,44.9 v64.45,46.95
  Bottom 0.3: FRDM1.PTC0 60.23,48.78 61,49.55 63.8,49.55 64.45,48.9 v64.45,46.95
EXPAN4
  Top 0.3: IC2.8 62.62,31.89 60.9,33.6 60.9,37.95 63,40.05 63,42.7 66.7,46.4 66.7,50.1 64.6,52.2 61.3,52.2 60.23,51.13 FRDM1.D1
GND  (via drill 0.3, 0.35, 0.45, 0.5)
  Top 0.3: 60.25,24.55 v60.5,24.3 59.75,25.05 IC3.7 | IC3.5 57.57,25.67 v57.3,25.4 | IC3.12 62.03,27.17 v62.1,27.25 | IC3.10 62.03,26.17 62.1,26.1 v62.1,25.8 | IC1.2 65.4,20.5 64.1,20.5 64,20.4 64,19.9 64.06,19.84 IC1.3 66.92,19.84 67.56,19.18 IC1.21 | IC2.3 64.17,35.13 64,35.3 64,35.6 64.2,35.8 65.27,35.8 IC2.2 67.06,35.78 67.8,35.05 67.8,32.15 67.15,31.5 67.15,29.95 66.48,29.29 IC2.12
  other vias: 39.05,24.55 76.45,16.45 22.2,40.9 57.8,17.75 47.2,24.95 32.25,24.6 22.95,33.15 15.1,32.65 10.7,31.3 2.9,27.65 23.35,20.95 51.1,27.05 55.7,37.55 53.8,35.75 15.6,45.65 20.9,24.2 7.75,24.8 39.15,19.75 29.6,20.95 42.85,7.5 23.2,1.4 37.15,8.05 34.3,11.25 29.55,8.65 74.9,36.85 77.95,21.35 58.15,29 44.95,31.85 74.15,16.5 59.85,16.4 79.95,15.25 79.85,14.05 35.35,8.9 39.4,7.7 65.25,49.8 67.75,35.95 67.4,18.6 69.5,15.4 19.65,40.8 57.8,35.3 58.3,22 57.55,26.8 15.7,13.15 36.55,23.7 41.8,24.55 34.85,40.2 39.3,40.2 40.65,40.2 71,49.85 33.9,12.65 55.6,15.65 54.95,25.3 67.35,29.35 66.15,25.15
  pour Top: 0.2,53.4 81.9,53.4 81.9,0.1 0.2,0.1
  pour Bottom: 0.2,53.4 81.9,53.4 81.9,0.2 0.2,0.2
IR_IN  (via drill 0.35)
  Top 0.3: FRDM1.D8 40,49.62 40,46.85 36.1,42.95 v36.1,33.5 | v35.45,23.6 v23.5,23.6
  Bottom 0.3: RASPBERRY_PI_PICO.GP6 22.13,22.5 23.23,23.6 v23.5,23.6 | 35.55,23.6 v35.45,23.6 35.8,23.95 35.8,33.2 v36.1,33.5
IR_OUT  (via drill 0.35)
  Top 0.3: FRDM1.D7 43.4,49.21 43.4,47.25 38.65,42.5 38.64,40.75 38.64,31.99 37.9,31.25 20.85,31.25 20.55,31.55 v18.95,31.55 | v12.7,25.55 5.96,25.55 1.81,21.4 RASPBERRY_PI_PICO.GP0
  Bottom 0.3: v18.95,31.55 18.7,31.55 v12.7,25.55
KNOCKER  (via drill 0.35)
  Top 0.3: IC2.6 63.02,33.19 62.15,34.05 62.15,37.35 64.65,39.85 64.65,43.5 v67.05,45.9
  Bottom 0.3: FRDM1.D6 47.35,50.8 46.3,49.75 46.3,47.3 47,46.6 55.25,46.6 56.35,45.5 65.3,45.5 65.8,46 66.95,46 v67.05,45.9
LED_B
  Top 0.406: RASPBERRY_PI_PICO.GP22 29.75,37.4 26.95,40.2 24.2,40.2 19.15,45.25 17.25,45.25 14.55,47.95 R1.1
LED_G
  Top 0.406: RASPBERRY_PI_PICO.GP26_A0 24.67,36.88 18.45,43.1 16.3,43.1 13.95,45.45 R2.1
LED_R
  Top 0.406: RASPBERRY_PI_PICO.GP27_A1 22.13,37.12 17.15,42.1 15.25,42.1 14.4,42.95 R3.1
N$8
  Top 0.5: LED1.3 5.9,43.7 6.65,42.95 R3.2
N$10
  Top 0.5: R1.2 3.9,47.95 3.1,47.15 LED1.2
N$13
  Top 0.5: LED1.4 7.03,46.12 7.7,45.45 R2.2
N$71
  Top 0.3: IC30.7 72.7,7.1 73.3,6.5 73.3,5.87 R4.2 R5.2
PICO_RUN  (via drill 0.35)
  Top 0.3: 6.44,7.58 7.97,7.58 13.24,12.84 13.24,21.59 v17.05,25.4
  Top 0.406: SW1.A 6.44,7.58 SW1.B
  Bottom 0.3: RASPBERRY_PI_PICO.RUN 27.21,33.46 26.1,32.35 24,32.35 v17.05,25.4
PLUNGER_ADC  (via drill 0.33, 0.45)
  Top 0.3: IC30.4 65.6,7.1 65.2,6.7 65.2,4.6 v64.35,3.75
  Top 0.4: RASPBERRY_PI_PICO.GP28_A2 17.05,32.01 18.94,30.12 49.24,30.12 v49.26,30.09
  Bottom 0.3: v64.35,3.75 51.55,3.75 51.3,3.5
  Bottom 0.4: FRDM1.A0 50.34,2.54 51.3,3.5 51.25,6.4 53.9,9.05 53.9,26.1 49.91,30.09 v49.26,30.09
PLUNGER_CAL_BTN  (via drill 0.33, 0.35)
  Top 0.3: IC2.4 66.86,34.48 v66.95,34.5 | FRDM1.PTE29 60.23,7.43 63.9,11.1 65.95,11.1 v66.5,11.65
  Bottom 0.3: v66.95,34.5 67.1,34.5 70.6,31 70.6,18.9 67.25,15.55 67.25,12.4 v66.5,11.65
PLUNGER_CAL_LED  (via drill 0.35)
  Top 0.3: IC2.5 66.56,33.84 v66.75,33.65 | FRDM1.PTE23 57.69,5.59 63.75,11.65 v65.35,11.65
  Bottom 0.3: v66.75,33.65 70.1,30.3 70.1,19.15 66.7,15.75 66.7,13 v65.35,11.65
PLUNGER_IRQ1_SCL  (via drill 0.35, 0.42)
  Top 0.3: FRDM1.D10 34.85,49.55 34.85,46.99 31.02,43.16 31.02,33 32.02,32 36.5,32 v36.7,31.8
  Top 0.4: RASPBERRY_PI_PICO.GP11 37.37,19.67 38.6,20.9 53.65,20.9 53.9,21.15 54.65,21.15 v54.8,21
  Bottom 0.3: RASPBERRY_PI_PICO.GP11 37.37,31.13 v36.7,31.8
  Bottom 0.4: FRDM1.PTE21 52.61,6.81 54.8,9 v54.8,21
PLUNGER_IRQ2  (via drill 0.35)
  Top 0.3: FRDM1.PTE22 53.68,6.55 47.15,6.55 v46.95,6.35 | FRDM1.D9 37.41,49.57 37.41,46.96 33.56,43.11 33.56,33.49 34.25,32.8 v38,32.8
  Top 0.4: FRDM1.PTE22 55.15,5.05
  Bottom 0.3: v46.95,6.35 46.95,6.7 42.45,11.2 RASPBERRY_PI_PICO.GP13 42.45,28.4 38.05,32.8 v38,32.8
PLUNGER_SDA  (via drill 0.42)
  Top 0.4: v52.4,21.6 37.1,21.6 34.83,19.33 RASPBERRY_PI_PICO.GP10
  Bottom 0.4: FRDM1.PTE20 50.07,6.12 53,9.05 53,21 v52.4,21.6
PSU2_STATUS_SENSE  (via drill 0.35)
  Top 0.3: IC1.20 78.28,18.54 v78.35,18.6 | v77.55,42.65 79.35,42.65 v79.4,42.6
  Bottom 0.3: FRDM1.D11 33.6,50.8 34.85,49.55 34.85,47 36.1,45.75 42.85,45.75 44.65,43.95 54.25,43.95 55.1,43.1 77.1,43.1 v77.55,42.65 | v78.35,18.6 81.45,21.85 81.45,40.55 v79.4,42.6
PSU2_STATUS_SET  (via drill 0.35)
  Top 0.3: IC1.19 78.89,17.89 79.95,18.95 79.95,39.05 78.95,40.05 76.1,40.05 v76,40.15
  Bottom 0.3: FRDM1.D14 20.86,50.74 22.15,49.45 22.15,45.95 22.95,45.15 27.9,45.15 30.5,42.55 41.65,42.55 43.35,40.85 52.95,40.85 53.75,40.05 75.9,40.05 v76,40.15
PWM_BLANK
  Top 0.4: RASPBERRY_PI_PICO.GP18 42.45,34.25 43.5,33.2 53.55,33.2 58.3,37.95 58.3,43.05 58.5,43.25 58.85,43.6 62.35,47.1 62.35,47.84 FRDM1.PTC7
PWM_GSCLK
  Top 0.4: RASPBERRY_PI_PICO.GP16 50.14,34.71 50.75,34.1 53.55,34.1 57.5,38.05 57.5,43.2 61.55,47.25 61.55,49.58 FRDM1.D0
PWM_SCLK  (via drill 0.42, 0.5)
  Top 0.4: 55.33,17.78 v55.65,18.1 54.48,16.93 RASPBERRY_PI_PICO.GP15 | v52.65,35.1 52.65,48.22 FRDM1.PTC5
  Bottom 0.4: v52.65,35.1 52.65,29.85 55.75,26.75 55.75,18.2 v55.65,18.1
PWM_SIN
  Top 0.3: RASPBERRY_PI_PICO.GP17 47.53,43.53 49.75,45.75 49.75,47.94 FRDM1.PTC6
PWM_XLAT
  Top 0.3: RASPBERRY_PI_PICO.GP19 39.91,40.64 FRDM1.PTC10
SCL  (via drill 0.33, 0.35, 0.5)
  Top 0.3: IC3.4 46.1,26.17 v45.8,25.9 | 67.65,22.15 67.1,22.7 42.6,22.7 | 67.65,22.15 67.84,21.96 67.84,20.81 68.81,19.84 IC1.22 73.17,19.84 v73.5,19.5 | RASPBERRY_PI_PICO.GP5 17.05,19.07 17.07,19.07 20.7,22.7 42.6,22.7 | IC2.22 69.83,35.13 69.2,34.5 v69.2,29.95 | v67.2,21.8 67.3,21.8 67.65,22.15 | v44,24.1 42.6,22.7 | IC30.10 v71.05,10.35
  Bottom 0.3: v44,24.1 v45.8,25.9 | v67.2,21.8 67.4,21.8 69.3,23.7 69.3,29.85 v69.2,29.95 | v71.05,10.35 71.05,15.7 73.5,18.15 v73.5,19.5
SDA  (via drill 0.33, 0.35)
  Top 0.3: IC3.6 59.25,24.32 59.79,23.78 | 59.79,23.78 60.15,23.42 67.28,23.42 | 67.28,23.42 68.62,22.08 68.62,21.06 69.19,20.48 IC1.23 72.86,20.48 v72.9,20.45 | RASPBERRY_PI_PICO.GP4 14.51,20.13 20.28,25.9 43.83,25.9 45.95,23.78 59.79,23.78 | IC2.23 69.28,35.78 68.5,35 v68.5,30.7 | 67.28,23.42 68.5,24.64 v68.5,25 | IC30.9 69.45,8.1 68.75,8.8 v68.75,9.35
  Bottom 0.3: v68.5,30.7 v68.5,25 v68.5,24.99 | v68.75,9.35 68.75,16.05 72.9,20.2 v72.9,20.45
TV_RELAY  (via drill 0.35)
  Top 0.3: IC2.7 62.77,32.53 61.5,33.8 61.5,37.75 63.5,39.75 63.5,40.95 64.1,41.55 v64.1,42
  Bottom 0.3: FRDM1.D12 31.02,50.73 32.3,49.45 32.3,47.2 34.8,44.7 42.45,44.7 44.25,42.9 53.85,42.9 53.85,42.85 54.6,42.1 64,42.1 v64.1,42

### Text on the board
tNames: REV 20241118 | PINSCAPE PICO / KL25Z EXPANSION BOARD ADAPTER | RASPBERRY PI PICO | RESET